# Altium schematic sheet UART_COM.SchDoc
size A4; SheetNumber: 8; SheetTotal: 8
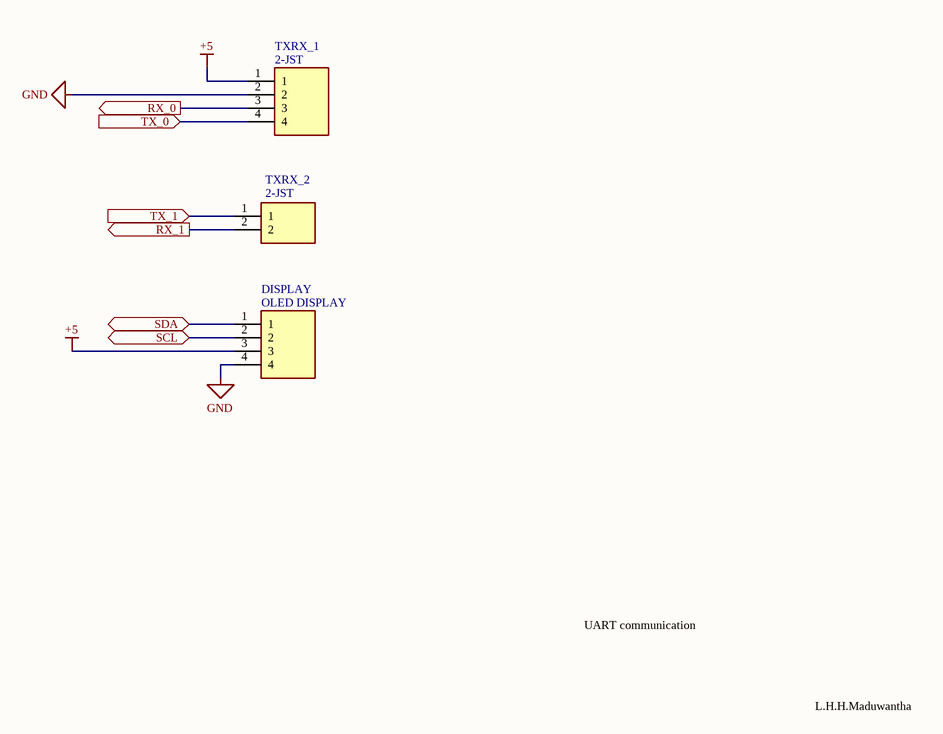
[diagram p0: UART_COM.SchDoc]

## Parts
DISPLAY  NAME: OLED DISPLAY  [B4BXHALFSN]  (hidden comment: B4B-XH-A_LF__SN_)
TXRX_1  NAME: 2-JST  [B4BXHALFSN]  (hidden comment: B4B-XH-A_LF__SN_)
TXRX_2  Name: 2-JST  [B2BXHAMLFSN]  (hidden comment: B2B-XH-AM_LF__SN_)

## Ports
RX_0 (out, see Main[3B], MCU[3C]), RX_1 (out, see Main[3C], MCU[3C]), SCL (bidir, see Main[3C], MCU[3C], PressureSensor[2C]), SDA (bidir, see Main[3C], MCU[3C], PressureSensor[2B]), TX_0 (in, see Main[3B], MCU[3C]), TX_1 (in, see Main[3C], MCU[3C])

## Nets
+5: DISPLAY.3 TXRX_1.1
GND: DISPLAY.4 TXRX_1.2
RX_0: TXRX_1.3 ; port RX_0
RX_1: TXRX_2.2 ; port RX_1
SCL: DISPLAY.2 ; port SCL
SDA: DISPLAY.1 ; port SDA
TX_0: TXRX_1.4 ; port TX_0
TX_1: TXRX_2.1 ; port TX_1

## Notes on the sheet
- UART communication
- L.H.H.Maduwantha

## Library data of the parts
DISPLAY TXRX_1 = B4B-XH-A_LF__SN_: Connector; Manufacturer_Name: JST (JAPAN SOLDERLESS TERMINALS); Manufacturer_Part_Number: B4B-XH-A(LF)(SN); Datasheet Link: https://datasheet.lcsc.com/szlcsc/JST-Sales-America-B4B-XH-A-LF-SN_C144395.pdf; Height: 7mm; Arrow Part Number: B4B-XH-A(LF)(SN); Arrow Price/Stock: https://www.arrow.com/en/products/b4b-xh-a-lf-sn/jst-manufacturing?region=europe
TXRX_2 = B2B-XH-AM_LF__SN_: Connector; Manufacturer_Name: JST (JAPAN SOLDERLESS TERMINALS); Manufacturer_Part_Number: B2B-XH-AM(LF)(SN); Datasheet Link: https://www.jst-mfg.com/product/pdf/eng/eXH.pdf; Height: 7mm; Arrow Part Number: B2B-XH-AM(LF)(SN); Arrow Price/Stock: https://www.arrow.com/en/products/b2b-xh-am-lf-sn/jst-manufacturing?region=europe